# Altium schematic sheet power_0.schdoc
size 292 x 204 mm; Device: A_A4; Symbol: A_A4; Name: A_A4; @Project Name: Odin; REV: 1.0; Date: 2024-09-25; Sheet: 1/1; Draw By: hsinr; Company: Rose Hulman Institute of Technology; Convert to PCB: yes; Add into BOM: yes; @Page No: 2; @Page Count: 10; @Schematic Name: Odin; @Board Name: Odin_V1.0.0; @Update Date: 2025-12-17; @Create Time: 14:52:40; @Update Time: 19:43:17; @Page Name: power_0; @Create Date: 2025-02-28
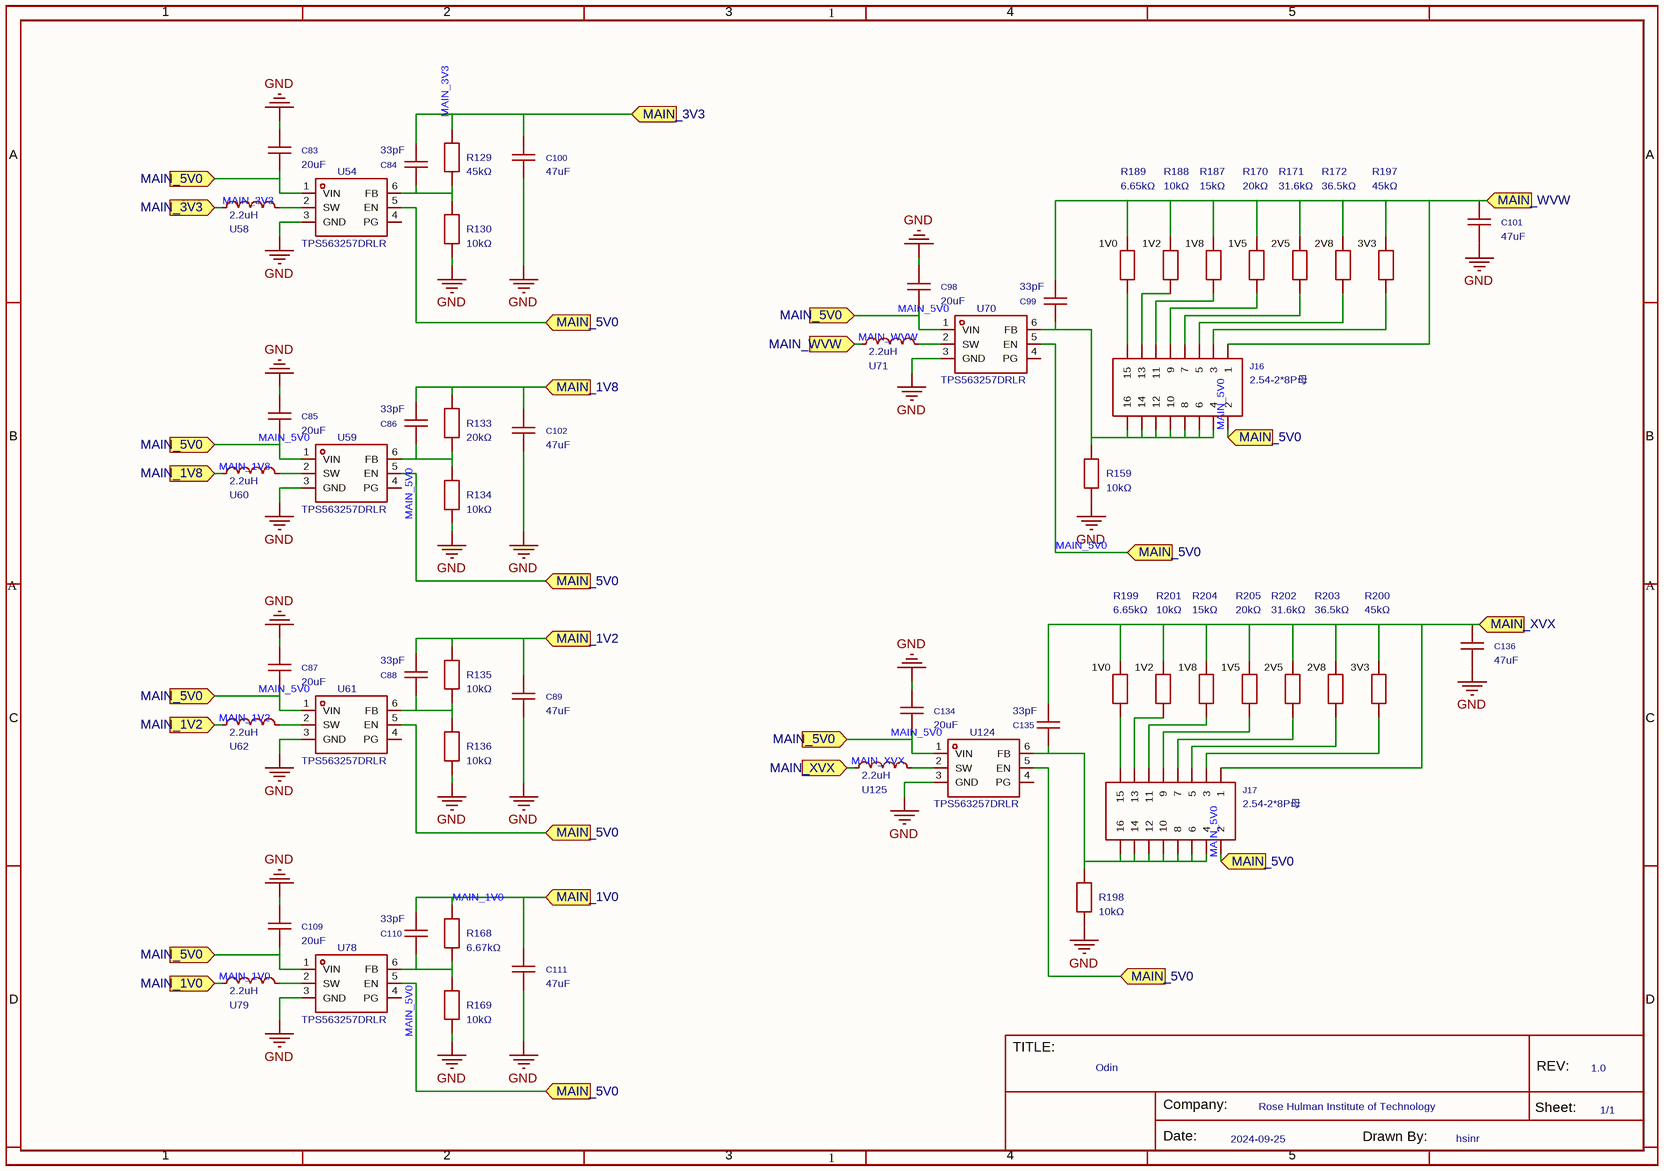
[diagram p0: power_0.schdoc]

## Parts
C83  20uF  [C0603]
C84  33pF  [C0603]
C85  20uF  [C0603]
C86  33pF  [C0603]
C87  20uF  [C0603]
C88  33pF  [C0603]
C89  47uF  [C0603]
C98  20uF  [C0603]
C99  33pF  [C0603]
C100  47uF  [C0603]
C101  47uF  [C0603]
C102  47uF  [C0603]
C109  20uF  [C0603]
C110  33pF  [C0603]
C111  47uF  [C0603]
C134  20uF  [C0603]
C135  33pF  [C0603]
C136  47uF  [C0603]
J16  2.54-2*8P母  [HDR-TH_16P-P2.54-V-F-R2-C8-S2.54]
J17  2.54-2*8P母  [HDR-TH_16P-P2.54-V-F-R2-C8-S2.54]
R129  45kΩ  [R0402]
R130  10kΩ  [R0402]
R133  20kΩ  [R0402]
R134  10kΩ  [R0402]
R135  10kΩ  [R0402]
R136  10kΩ  [R0402]
R159  10kΩ  [R0402]
R168  6.67kΩ  [R0402]
R169  10kΩ  [R0402]
R170  20kΩ  [R0402]
R171  31.6kΩ  [R0402]
R172  36.5kΩ  [R0402]
R187  15kΩ  [R0402]
R188  10kΩ  [R0402]
R189  6.65kΩ  [R0402]
R197  45kΩ  [R0402]
R198  10kΩ  [R0402]
R199  6.65kΩ  [R0402]
R200  45kΩ  [R0402]
R201  10kΩ  [R0402]
R202  31.6kΩ  [R0402]
R203  36.5kΩ  [R0402]
R204  15kΩ  [R0402]
R205  20kΩ  [R0402]
U54  TPS563257DRLR  [SOT-666-6_L1.6-W1.2-P0.50-LS1.6-BR]
U58  2.2uH  [IND-SMD_L2.5-W2.0_YXMBL252010P]
U59  TPS563257DRLR  [SOT-666-6_L1.6-W1.2-P0.50-LS1.6-BR]
U60  2.2uH  [IND-SMD_L2.5-W2.0_YXMBL252010P]
U61  TPS563257DRLR  [SOT-666-6_L1.6-W1.2-P0.50-LS1.6-BR]
U62  2.2uH  [IND-SMD_L2.5-W2.0_YXMBL252010P]
U70  TPS563257DRLR  [SOT-666-6_L1.6-W1.2-P0.50-LS1.6-BR]
U71  2.2uH  [IND-SMD_L2.5-W2.0_YXMBL252010P]
U78  TPS563257DRLR  [SOT-666-6_L1.6-W1.2-P0.50-LS1.6-BR]
U79  2.2uH  [IND-SMD_L2.5-W2.0_YXMBL252010P]
U124  TPS563257DRLR  [SOT-666-6_L1.6-W1.2-P0.50-LS1.6-BR]
U125  2.2uH  [IND-SMD_L2.5-W2.0_YXMBL252010P]

## Ports
MAIN_1V0 (in), MAIN_1V2 (in), MAIN_1V8 (in), MAIN_3V3 (in), MAIN_5V0 (in), MAIN_WVW (in), MAIN_XVX (in)

## Nets
GND: C83.2 C85.2 C87.2 C89.1 C98.2 C100.1 C101.1 C102.1 C109.2 C111.1 C134.2 C136.1 R130.2 R134.2 R136.2 R159.2 R169.2 R198.2 U54.3(GND) U59.3(GND) U61.3(GND) U70.3(GND) U78.3(GND) U124.3(GND)
MAIN_1V0: C110.2 C111.2 R168.1 U79.1 ; port MAIN_1V0
MAIN_1V2: C88.2 C89.2 R135.1 U62.1 ; port MAIN_1V2
MAIN_1V8: C86.2 C102.2 R133.1 U60.1 ; port MAIN_1V8
MAIN_3V3: C84.2 C100.2 R129.1 U58.1 ; port MAIN_3V3
MAIN_5V0: C83.1 C85.1 C87.1 C98.1 C109.1 C134.1 J16.2 J17.2 U54.1(VIN) U54.5(EN) U59.1(VIN) U59.5(EN) U61.1(VIN) U61.5(EN) U70.1(VIN) U70.5(EN) U78.1(VIN) U78.5(EN) U124.1(VIN) U124.5(EN) ; port MAIN_5V0
MAIN_WVW: C99.2 C101.2 J16.1 R170.1 R171.1 R172.1 R187.1 R188.1 R189.1 R197.1 U71.1 ; port MAIN_WVW
MAIN_XVX: C135.2 C136.2 J17.1 R199.1 R200.1 R201.1 R202.1 R203.1 R204.1 R205.1 U125.1 ; port MAIN_XVX
NetC84_1: C84.1 R129.2 R130.1 U54.6(FB)
NetC86_1: C86.1 R133.2 R134.1 U59.6(FB)
NetC88_1: C88.1 R135.2 R136.1 U61.6(FB)
NetC99_1: C99.1 J16.4 J16.6 J16.8 J16.10 J16.12 J16.14 J16.16 R159.1 U70.6(FB)
NetC110_1: C110.1 R168.2 R169.1 U78.6(FB)
NetC135_1: C135.1 J17.4 J17.6 J17.8 J17.10 J17.12 J17.14 J17.16 R198.1 U124.6(FB)
NetJ16_3: J16.3 R197.2
NetJ16_5: J16.5 R172.2
NetJ16_7: J16.7 R171.2
NetJ16_9: J16.9 R170.2
NetJ16_11: J16.11 R187.2
NetJ16_13: J16.13 R188.2
NetJ16_15: J16.15 R189.2
NetJ17_3: J17.3 R200.2
NetJ17_5: J17.5 R203.2
NetJ17_7: J17.7 R202.2
NetJ17_9: J17.9 R205.2
NetJ17_11: J17.11 R204.2
NetJ17_13: J17.13 R201.2
NetJ17_15: J17.15 R199.2
NetU54_2: U54.2(SW) U58.2
NetU59_2: U59.2(SW) U60.2
NetU61_2: U61.2(SW) U62.2
NetU70_2: U70.2(SW) U71.2
NetU78_2: U78.2(SW) U79.2
NetU124_2: U124.2(SW) U125.2

Not connected (* = marked no-connect by the designer): U54 4(PG); U59 4(PG); U61 4(PG); U70 4(PG); U78 4(PG); U124 4(PG)

## Notes on the sheet
- (near R189) 1V0
- 1V2
- 1V8
- 1V5
- 2V5
- 2V8
- 3V3
- (near R199) 1V0
- 1
- 2
- 3
- 4
- 5
- A
- B
- C
- D
- TITLE:
- Odin
- Company:
- Rose Hulman Institute of Technology
- Sheet:
- REV:
- 1.0
- 1/1
- Date:
- 2024-09-25
- Drawn By:
- hsinr

## Library data of the parts
C83-C89 C98-C102 C109-C111 C134-C136 = CL10B223KB8NNNC: Capacitance:22nF Tolerance:±10% Tolerance:±10% Voltage Rating:50V Temperature Coefficient:X7R; Manufacturer: SAMSUNG(三星); AddInBom: yes; ModelId: 624118aa3cc7497086c383c2d72e0852; ModelName: C0603_L1.6-W0.8-H0.8; ModelTransform: 62.992,31.496,0,0,0,0,0,0,0; Tolerance: ±10%; Voltage Rating: 50V; Temperature Coefficient: X7R; Symbol: CL10B223KB8NNNC; Device: CL10B223KB8NNNC; Supplier: LCSC; Manufacturer Part: CL10B223KB8NNNC; JLCPCB Part Class: Basic Part; LCSC Part Name: 22nF ±10% 50V; Supplier Footprint: 0603; Datasheet: https://item.szlcsc.com/datasheet/CL10B223KB8NNNC/21834.html; ConvertToPcb: yes; FootprintName: C0603
  C83 C85 C87 C98 C109 C134: Value: 20uF
  C84 C86 C88 C99 C110 C135: Value: 33pF
  C89 C100-C102 C111 C136: Value: 47uF
J16 J17 = 2.54-2*8P母: Holes Structure:2x8P Pitch:2.54mm Row Spacing:2.54mm Circular Hole / Square Hole:Square Hole Mounting Type:Through Hole Number of Rows:2 Number of Positions:16P Current Rating:2.5A Holes Direction:Top Insulation Height:8.5mm Contact Material:Brass Contact; Manufacturer: BOOMELE(博穆精密); Symbol: Header-Female-2.54_2x8; AddInBom: yes; ModelId: 0227b0d256bf4f04baed749f079520a9; ModelName: HDR-TH_16P-P2.54-F-LI-2X8P; ModelTransform: 815.746,196.85,0,0,0,0,0,0,-129.921; Holes Structure: 2x8P; Pitch: 2.54mm; Number of Positions: 16P; Current Rating: 2.5A; Holes Direction: Top; PIN Length: 3.1mm; Device: 2.54-2*8P母; Supplier: LCSC; Manufacturer Part: 2.54-2*8P母; Supplier Part: C30734; JLCPCB Part Class: Extended Part; LCSC Part Name: 2x8P 间距:2.54mm 直插; Supplier Footprint: 插件,P=2.54mm; Datasheet: https://item.szlcsc.com/datasheet/2.54-2*8P%25E6%25AF%258D/31491.html; ConvertToPcb: yes; FootprintName: HDR-TH_16P-P2.54-V-F-R2-C8-S2.54; Row Spacing: 2.54mm; Circular Hole / Square Hole: Square Hole; Mounting Type: Through Hole; Number of Rows: 2; Insulation Height: 8.5mm; Contact Material: Brass; Contact Plating: Gold; Operating Temperature: -55℃~+105℃
R129 R130 R133-R136 R159 R168-R172 R187-R189 R197-R205 = FRC0402F3002TS: Type:Thick Film Resistor Resistance:30kΩ Tolerance:±1% Tolerance:±1% Power(Watts):62.5mW Voltage-Supply(Max):50V Temperature Coefficient:±100ppm/℃ Temperature Coefficient:±100ppm/℃ Operating Temperature:-55℃~+155℃ Operating Temperature:-55℃~+155℃; Manufacturer: FOJAN(富捷); AddInBom: yes; ModelId: efdecb7dae4442949d28eecaf748420f; ModelName: R0402_L1.0-W0.5-H0.4; ModelTransform: 39.37,19.685,0,0,0,0,0,0,0; Tolerance: ±1%; Power(Watts): 62.5mW; Voltage-Supply(Max): 50V; Symbol: FRC0402F3002TS; Device: FRC0402F3002TS; LCSC Part Name: 30kΩ ±1% 62.5mW 厚膜电阻; ManufacturerPart: FRC0402F3002TS; Supplier Footprint: 0402; JLCPCB Part Class: Extended Part; Supplier: LCSC; ConvertToPcb: yes; FootprintName: R0402; Type: Thick Film Resistor; Temperature Coefficient: ±100ppm/℃; Operating Temperature: -55℃~+155℃
  R129 R197 R200: Value: 45kΩ
  R130 R134-R136 R159 R169 R188 R198 R201: Value: 10kΩ
  R133 R170 R205: Value: 20kΩ
  R168: Value: 6.67kΩ
  R171 R202: Value: 31.6kΩ
  R172 R203: Value: 36.5kΩ
  R187 R204: Value: 15kΩ
  R189 R199: Value: 6.65kΩ
U54 U59 U61 U70 U78 U124 = TPS563257DRLR: Function:- Output Type:- Voltage - Supply:3V~17V Voltage - Supply:3V~17V Output Voltage:- Output Voltage:- Output Current:3A Frequency - Switching:1.2MHz Frequency - Switching:1.2MHz Operating Temperature:-40℃~+125℃@(TJ) Operating Temperature:-40℃~+125℃@(; Manufacturer: TI(德州仪器); AddInBom: yes; ModelId: d819e0c908004c6d9ba8e512fd29870d; ModelName: SOT-666-6P_L1.6-W1.2-H0.6-LS1.6-P0.50; ModelTransform: 62.992,62.992,0,180,0,0,-0.001,1.18,0; Voltage - Supply: 3V~17V; Output Current: 3A; Frequency - Switching: 1.2MHz; Number of Outputs: 1; Topology: Step-down; Switch tube (built-in/external): Built-in; Symbol: TPS563257DRLR; Device: TPS563257DRLR; LCSC Part Name: 3V至17V输入，3A输出，同步降压转换器; SupplierPart: C20539656; ManufacturerPart: TPS563257DRLR; Supplier Footprint: SOT-5X3-6; JLCPCB Part Class: Extended Part; Datasheet: https://atta.szlcsc.com/upload/public/pdf/source/20240112/9CB98D9F60FBD6A61DFAE2E35E027040.pdf; Supplier: LCSC; ConvertToPcb: yes; FootprintName: SOT-666-6_L1.6-W1.2-P0.50-LS1.6-BR; Function: -; Output Type: -; Output Voltage: -; Operating Temperature: -40℃~+125℃@(TJ); Synchronous Rectifier: Yes; Quiescent Current: -
U58 U60 U62 U71 U79 U125 = APH252010T2R2M: Inductance:2.2uH Tolerance:±20% Tolerance:±20% Current Rating:2.1A Current - Saturation(Isat):3A DC Resistance(DCR):70mΩ Type:Molded Inductor Ratings:-; Manufacturer: APV(爱普微); AddInBom: yes; ModelId: 4bd47527e6f04118aa3130d457affb74; ModelTransform: 99.2124,78.74,0,0,0,0,0,0,0; Tolerance: ±20%; Current Rating: 2.1A; Current - Saturation(Isat): 3A; DC Resistance(DCR): 70mΩ; Symbol: APH252010T2R2M; Device: APH252010T2R2M; LCSC Part Name: 2.2uH ±20% 3A 2.5x2x1mm; SupplierPart: C5349606; ManufacturerPart: APH252010T2R2M; Supplier Footprint: 1008; JLCPCB Part Class: Extended Part; Datasheet: https://item.szlcsc.com/datasheet/APH252010T2R2M/6135021.html; Supplier: LCSC; ConvertToPcb: yes; FootprintName: IND-SMD_L2.5-W2.0_YXMBL252010P; ModelName: IND-SMD_L2.5-W2.0_YXMBL252010P; Value: 2.2uH; Type: Molded Inductor; Ratings: -